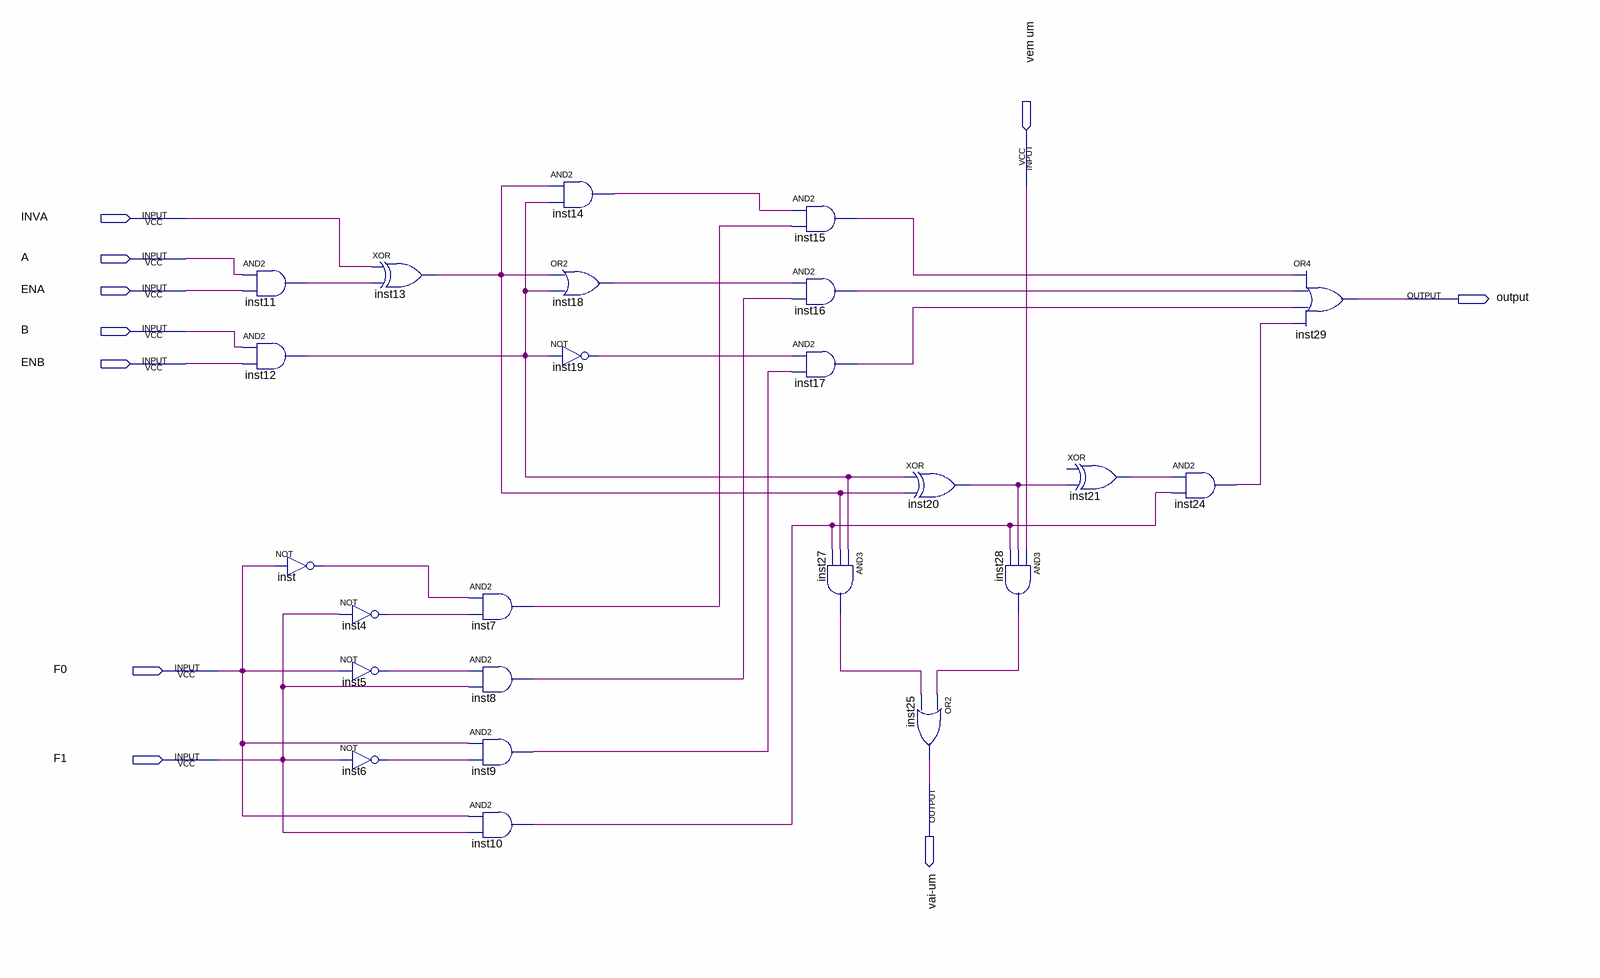
[diagram p0: schematic sheet]
// Quartus schematic ULA 1bit.bdf as structural Verilog: 24 symbols, 10 pins
module \ULA_1bit  (
  input  \vem_um ,
  input  INVA,
  input  A,
  input  ENA,
  input  B,
  input  ENB,
  input  F0,
  input  F1,
  output \output ,
  output \vai-um 
);

  wire inst4_out, inst5_out, inst6_out, inst7_out, inst8_out, inst9_out, inst10_out, inst11_out, inst12_out,
       inst13_out, inst14_out, inst15_out, inst16_out, inst17_out, inst18_out, inst19_out, inst20_out,
       inst21_out, inst24_out, inst27_out, inst28_out, inst_out;

  and inst11 (inst11_out, A, ENA);
  and inst12 (inst12_out, B, ENB);
  not inst (inst_out, F0);
  not inst4 (inst4_out, F1);
  not inst5 (inst5_out, F0);
  not inst6 (inst6_out, F1);
  xor inst13 (inst13_out, INVA, inst11_out);
  and inst7 (inst7_out, inst_out, inst4_out);
  and inst8 (inst8_out, inst5_out, F1);
  and inst9 (inst9_out, F0, inst6_out);
  and inst10 (inst10_out, F0, F1);
  and inst14 (inst14_out, inst13_out, inst12_out);
  or inst18 (inst18_out, inst13_out, inst12_out);
  not inst19 (inst19_out, inst12_out);
  and inst15 (inst15_out, inst14_out, inst7_out);
  and inst16 (inst16_out, inst18_out, inst8_out);
  and inst17 (inst17_out, inst19_out, inst9_out);
  and inst27 (inst27_out, inst12_out, inst13_out, inst10_out);
  xor inst20 (inst20_out, inst12_out, inst13_out);
  or inst25 (\vai-um , inst28_out, inst27_out);
  and inst28 (inst28_out, \vem_um , inst20_out, inst10_out);
  buf inst21 (inst21_out, inst20_out);  // XOR open: IN1
  and inst24 (inst24_out, inst21_out, inst10_out);
  or inst29 (\output , inst15_out, inst16_out, inst17_out, inst24_out);
endmodule
